# EAGLE schematic logica (EAGLE 6.1)

## Sheet 1 of 3: Arduino
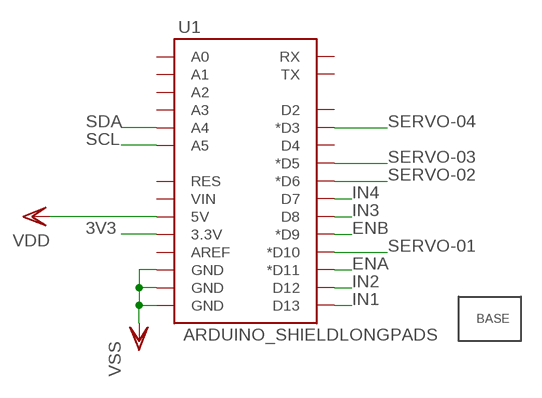
[diagram p0: schematic, sheet 1]

### Parts
U1  ARDUINO_SHIELDLONGPADS  [DUEMILANOVE_SHIELD_LONGPADS]
U$4  BASE  [BASE]

### Nets
3V3: U1.3.3V ; also sheet 2
D7: U1.D7 ; also sheet 3
D8: U1.D8 ; also sheet 3
D9: U1.D9(*D9) ; also sheet 3
D11: U1.D11(*D11) ; also sheet 3
D12: U1.D12 ; also sheet 3
D13: U1.D13 ; also sheet 3
SCL: U1.A5 ; also sheet 2
SDA: U1.A4 ; also sheet 2
SERVO-01: U1.D10(*D10)
SERVO-02: U1.D6(*D6)
SERVO-03: U1.D5(*D5)
SERVO-04: U1.D3(*D3)
VDD: U1.5V ; also sheet 2,3
VSS: U1.GND@0(GND) U1.GND@1(GND) U1.GND@2(GND) ; also sheet 2,3
Unconnected: U1.A0 U1.A1 U1.A2 U1.A3 U1.AREF U1.D2 U1.D4 U1.RES U1.RX U1.TX U1.VIN

### Notes on the sheet
- IN4
- IN3
- ENB
- ENA
- IN2
- IN1

## Sheet 2 of 3: IMU300 Combo
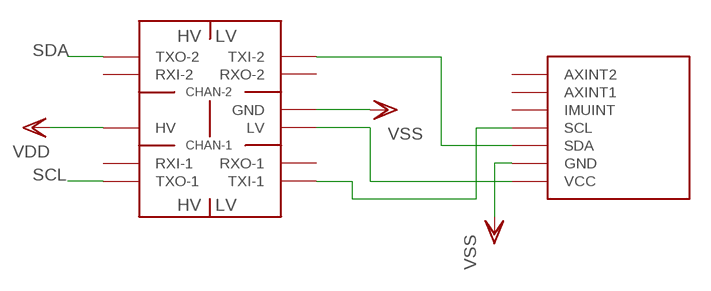
[diagram p1: schematic, sheet 2]

### Parts
U$1  LOGIC-LEVEL-CONVERTER  [LEVEL-CONVERTER]
U$2  IMU3000COMBO  [IMU3000-COMBO]

### Nets
3V3: U$1.P$3(LV) U$2.3V3(VCC) ; also sheet 1
N$1: U$1.P$1(TXI-1) U$2.SCL
N$2: U$1.P$6(TXI-2) U$2.SDA
SCL: U$1.P$12(TXO-1) ; also sheet 1
SDA: U$1.P$7(TXO-2) ; also sheet 1
VDD: U$1.P$10(HV) ; also sheet 1,3
VSS: U$1.P$4(GND) U$2.VSS(GND) ; also sheet 1,3
Unconnected: U$1.P$2(RXO-1) U$1.P$5(RXO-2) U$1.P$8(RXI-2) U$1.P$11(RXI-1) U$2.AXINT1 U$2.AXINT2 U$2.IMUINT

## Sheet 3 of 3: L298
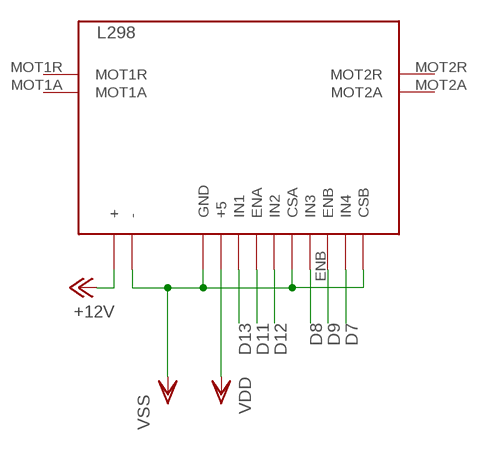
[diagram p2: schematic, sheet 3]

### Parts
L298  UK1122  [UK1122]

### Nets
+12V: L298.+
D7: L298.IN4 ; also sheet 1
D8: L298.IN3 ; also sheet 1
D9: L298.ENB ; also sheet 1
D11: L298.ENA ; also sheet 1
D12: L298.EN2(IN2) ; also sheet 1
D13: L298.IN1 ; also sheet 1
VDD: L298.+5 ; also sheet 1,2
VSS: L298.- L298.CSA L298.CSB L298.GND ; also sheet 1,2
Unconnected: L298.MOT1A L298.MOT1R L298.MOT2A L298.MOT2R

## Power pins joined to a net without a drawn wire
: U$1.P$9

## Library data of the parts
L298 = aasanchez:UK1122
U1 = SparkFun:ARDUINO_SHIELD
U$1 = aasanchez:LOGIC-LEVEL-CONVERTER
U$2 = aasanchez:IMU3000COMBO
U$4 = aasanchez:BASE